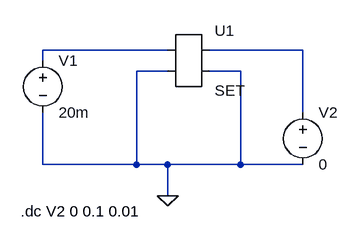
[diagram p0: schematic Draft3.asc]
Draft3.asc, the LTspice schematic file:
Version 4
SHEET 1 880 680
WIRE 160 112 -32 112
WIRE 368 112 224 112
WIRE -32 128 -32 112
WIRE 160 144 112 144
WIRE 272 144 224 144
WIRE 368 208 368 112
WIRE -32 288 -32 208
WIRE 112 288 112 144
WIRE 112 288 -32 288
WIRE 160 288 112 288
WIRE 272 288 272 144
WIRE 272 288 160 288
WIRE 368 288 272 288
WIRE 160 336 160 288
FLAG 160 336 0
SYMBOL AutoGenerated\\SET 192 128 R0
SYMATTR InstName U1
SYMBOL voltage -32 112 R0
SYMATTR InstName V1
SYMATTR Value 20m
SYMBOL voltage 368 192 R0
SYMATTR InstName V2
SYMATTR Value 0
TEXT -66 360 Left 2 !.dc V2 0 0.1 0.01

The netlist it stands for:
* Draft3.asc
* U1: SET (symbol AutoGenerated\SET not available, pins judged from their places): pin1=N001 pin2=0 pin3=N002 pin4=0
V1 N001 0 20m
V2 N002 0 0
.dc V2 0 0.1 0.01
.backanno
.end